# Altium schematic sheet client.SchDoc
size A3
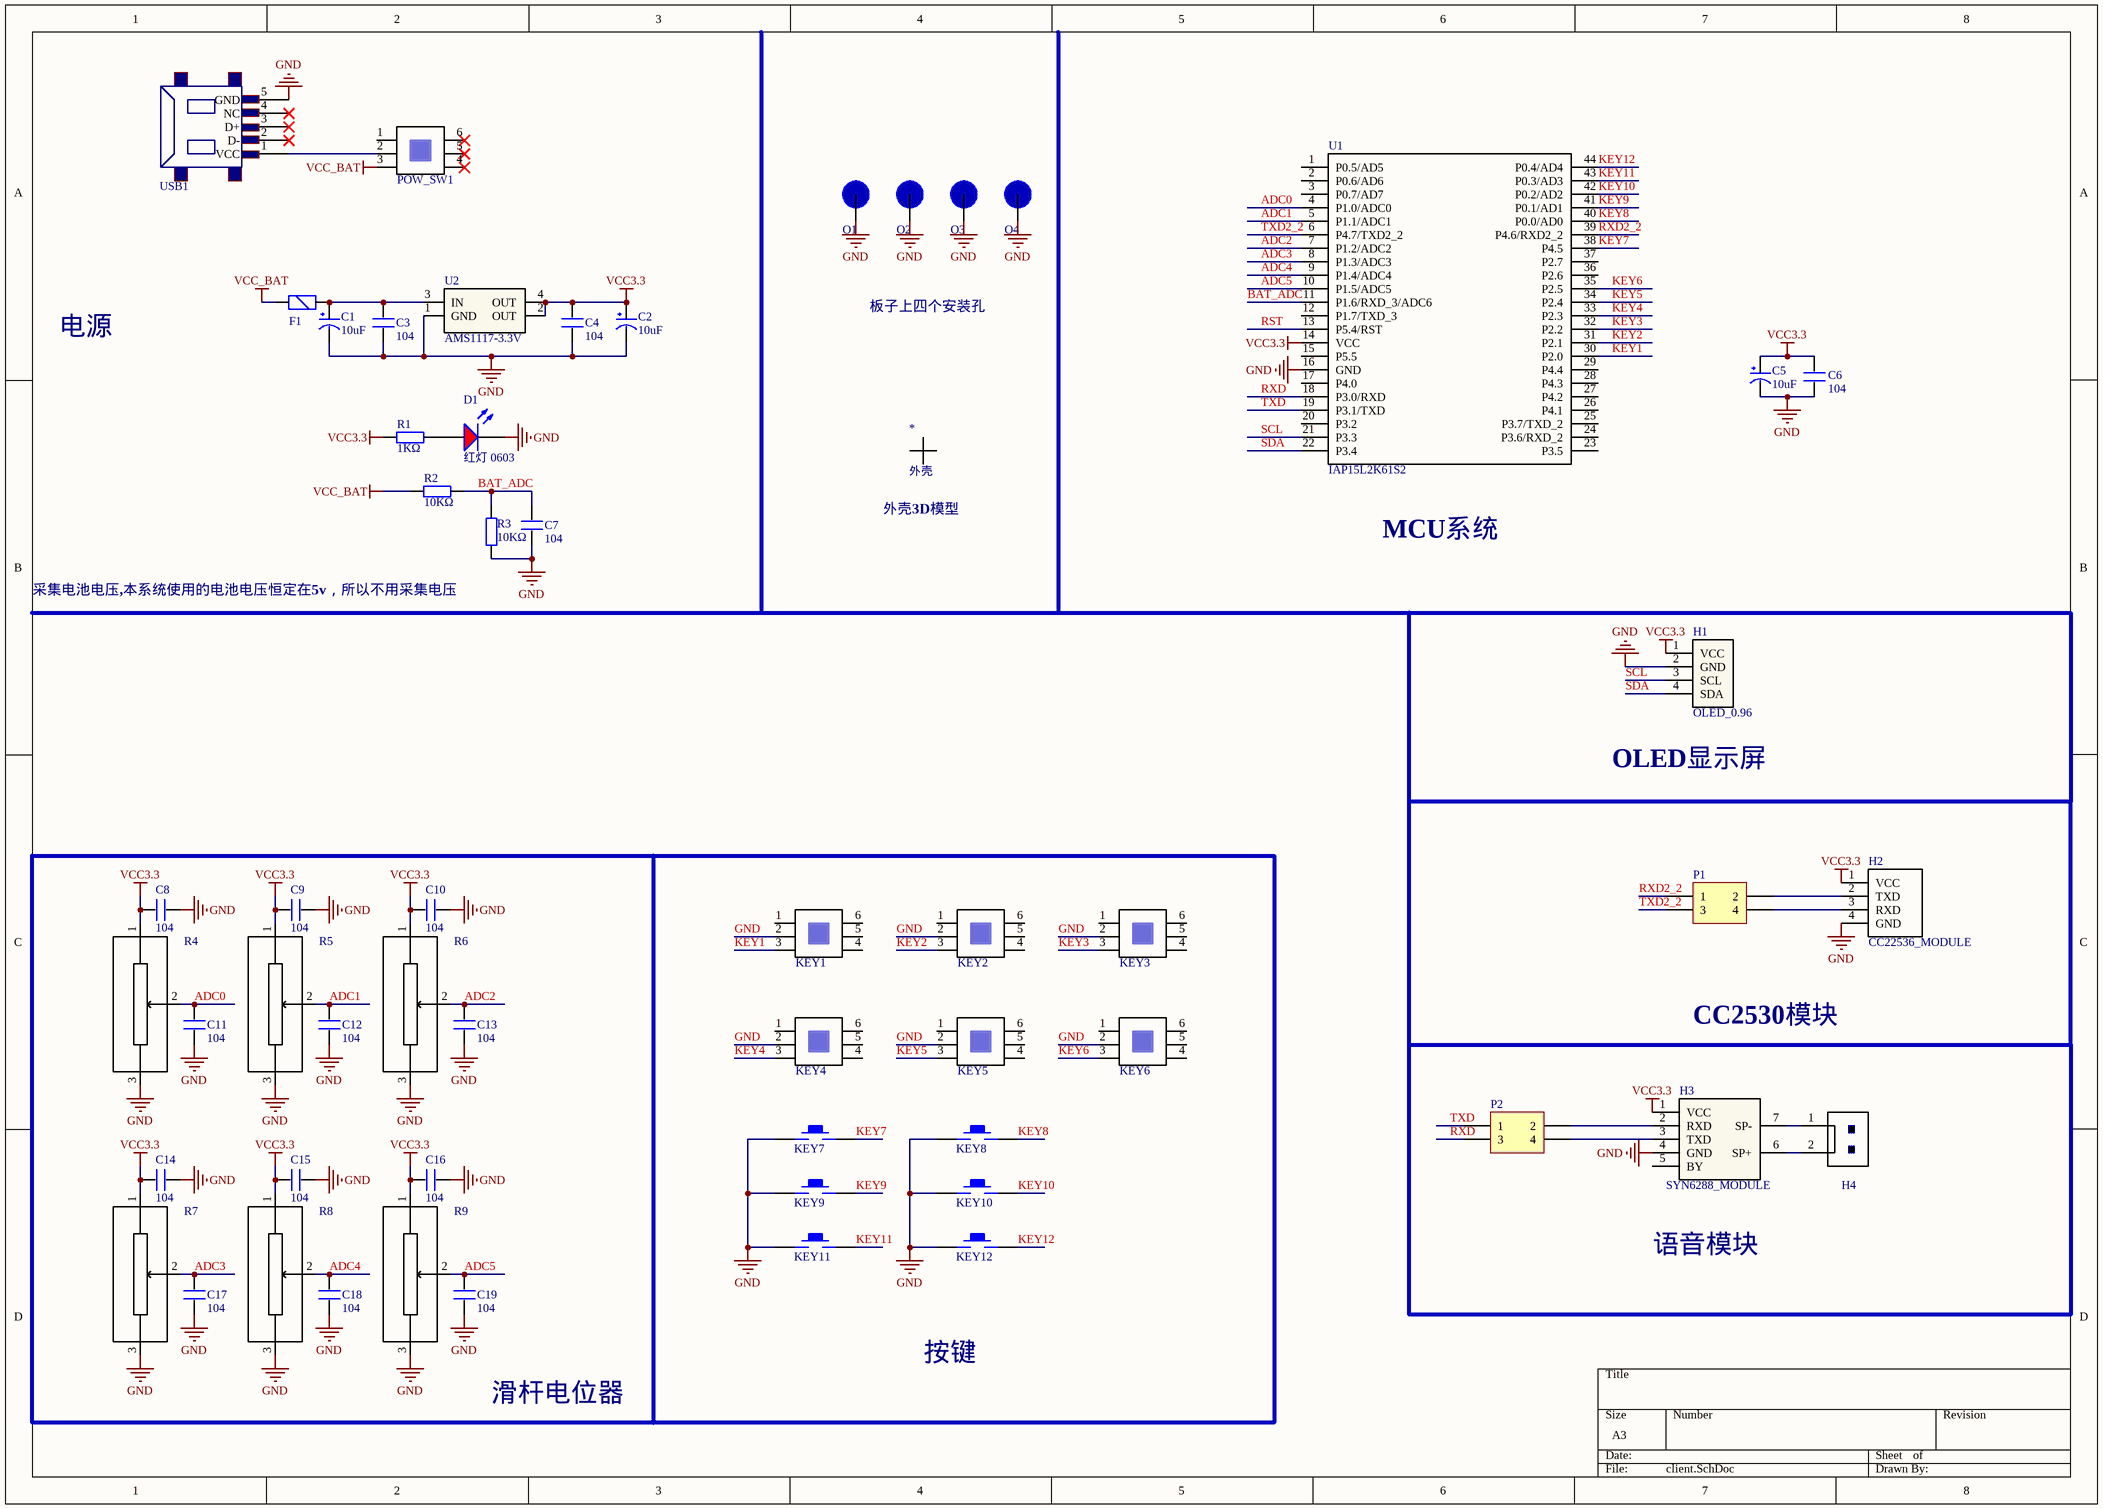
[diagram p0: client.SchDoc]

## Parts
*  外壳  [外壳]
C1  10uF  [C4X4]
C2  10uF  [C4X4]
C3  104  [0603_C]
C4  104  [0603_C]
C5  10uF  [C4X4]
C6  104  [0603_C]
C7  104  [0603_C]
C8  104  [0603_C]
C9  104  [0603_C]
C10  104  [0603_C]
C11  104  [0603_C]
C12  104  [0603_C]
C13  104  [0603_C]
C14  104  [0603_C]
C15  104  [0603_C]
C16  104  [0603_C]
C17  104  [0603_C]
C18  104  [0603_C]
C19  104  [0603_C]
D1  红灯 0603  [0603_LED_S1]
F1  F1  [Fuse1210]  (value not drawn)
H1  OLED_0.96  [HDR1X4]
H2  CC22536_MODULE  [HDR1X4]
H3  SYN6288_MODULE  [SYN6288_MODULE]
H4  排插2*1  [XH2.54mm_2*1]  (value not drawn)
KEY1  switch6pin  [SWITCH_6PIN_8*8mm]  (value not drawn)
KEY2  switch6pin  [SWITCH_6PIN_8*8mm]  (value not drawn)
KEY3  switch6pin  [SWITCH_6PIN_8*8mm]  (value not drawn)
KEY4  switch6pin  [SWITCH_6PIN_8*8mm]  (value not drawn)
KEY5  switch6pin  [SWITCH_6PIN_8*8mm]  (value not drawn)
KEY6  switch6pin  [SWITCH_6PIN_8*8mm]  (value not drawn)
KEY7  KEY_M  [KEY_SMD_6*6*12mm]  (value not drawn)
KEY8  KEY_M  [KEY_SMD_6*6*12mm]  (value not drawn)
KEY9  KEY_M  [KEY_SMD_6*6*12mm]  (value not drawn)
KEY10  KEY_M  [KEY_SMD_6*6*12mm]  (value not drawn)
KEY11  KEY_M  [KEY_SMD_6*6*12mm]  (value not drawn)
KEY12  KEY_M  [KEY_SMD_6*6*12mm]  (value not drawn)
O1  安装孔3mm  (value not drawn)
O2  安装孔3mm  (value not drawn)
O3  安装孔3mm  (value not drawn)
O4  安装孔3mm  (value not drawn)
P1  (no value)  [HDR2X2]
P2  (no value)  [HDR2X2]
POW_SW1  switch6pin  [SWITCH_6PIN_8*8mm]  (value not drawn)
R1  1KΩ  [0603_R]
R2  10KΩ  [0603_R]
R3  10KΩ  [0603_R]
R4  滑杆电位器  [滑杆电位器128mm]  (value not drawn)
R5  滑杆电位器  [滑杆电位器128mm]  (value not drawn)
R6  滑杆电位器  [滑杆电位器128mm]  (value not drawn)
R7  滑杆电位器  [滑杆电位器128mm]  (value not drawn)
R8  滑杆电位器  [滑杆电位器128mm]  (value not drawn)
R9  滑杆电位器  [滑杆电位器128mm]  (value not drawn)
U1  IAP15L2K61S2  [LQFP44]
U2  AMS1117-3.3V  [SOT-223]
USB1  USB1  [USB_MK5P]

## Nets
GND: C1.2(GND) C2.2(GND) C3.2 C4.2 C5.2(GND) C6.2 C7.2 C8.2 C9.2 C10.2 C11.2 C12.2 C13.2 C14.2 C15.2 C16.2 C17.2 C18.2 C19.2 D1.K H1.2(GND) H2.4(GND) H3.4(GND) KEY1.2 KEY2.2 KEY3.2 KEY4.2 KEY5.2 KEY6.2 KEY7.1 KEY8.1 KEY9.1 KEY10.1 KEY11.1 KEY12.1 O1.0(GND) O2.0(GND) O3.0(GND) O4.0(GND) R3.1 R4.3 R5.3 R6.3 R7.3 R8.3 R9.3 U1.16(GND) U2.1(GND) USB1.5(GND)
VCC3.3: C2.1(VCC) C4.1 C5.1(VCC) C6.1 C8.1 C9.1 C10.1 C14.1 C15.1 C16.1 H1.1(VCC) H2.1(VCC) H3.1(VCC) R1.1 R4.1 R5.1 R6.1 R7.1 R8.1 R9.1 U1.14(VCC) U2.2(OUT) U2.4(OUT)
VCC_BAT: F1.2 POW_SW1.3 R2.1
ADC0: C11.1 R4.2 U1.4(P1.0/ADC0)
ADC1: C12.1 R5.2 U1.5(P1.1/ADC1)
ADC2: C13.1 R6.2 U1.7(P1.2/ADC2)
ADC3: C17.1 R7.2 U1.8(P1.3/ADC3)
ADC4: C18.1 R8.2 U1.9(P1.4/ADC4)
ADC5: C19.1 R9.2 U1.10(P1.5/ADC5)
BAT_ADC: C7.1 R2.2 R3.2 U1.11(P1.6/RXD_3/ADC6)
KEY1: KEY1.3 U1.30(P2.0)
KEY2: KEY2.3 U1.31(P2.1)
KEY3: KEY3.3 U1.32(P2.2)
KEY4: KEY4.3 U1.33(P2.3)
KEY5: KEY5.3 U1.34(P2.4)
KEY6: KEY6.3 U1.35(P2.5)
KEY7: KEY7.2 U1.38(P4.5)
KEY8: KEY8.2 U1.40(P0.0/AD0)
KEY9: KEY9.2 U1.41(P0.1/AD1)
KEY10: KEY10.2 U1.42(P0.2/AD2)
KEY11: KEY11.2 U1.43(P0.3/AD3)
KEY12: KEY12.2 U1.44(P0.4/AD4)
RST: U1.13(P5.4/RST)
RXD: P2.3 U1.18(P3.0/RXD)
RXD2_2: P1.1 U1.39(P4.6/RXD2_2)
SCL: H1.3(SCL) U1.21(P3.3)
SDA: H1.4(SDA) U1.22(P3.4)
TXD: P2.1 U1.19(P3.1/TXD)
TXD2_2: P1.3 U1.6(P4.7/TXD2_2)
NetC1_1: C1.1(VCC) C3.1 F1.1 U2.3(IN)
NetD1_A: D1.A R1.2
NetH2_2: H2.2(TXD) P1.2
NetH2_3: H2.3(RXD) P1.4
NetH3_2: H3.2(RXD) P2.2
NetH3_3: H3.3(TXD) P2.4
NetH3_6: H3.6(SP+) H4.2(SP+)
NetH3_7: H3.7(SP-) H4.1(SP-)
NetPOW_SW1_2: POW_SW1.2 USB1.1(VCC)

Not connected (* = marked no-connect by the designer): H3 5(BY); KEY1 1 4 5 6; KEY2 1 4 5 6; KEY3 1 4 5 6; KEY4 1 4 5 6; KEY5 1 4 5 6; KEY6 1 4 5 6; POW_SW1 1 4* 5* 6*; U1 1(P0.5/AD5) 2(P0.6/AD6) 3(P0.7/AD7) 12(P1.7/TXD_3) 15(P5.5) 17(P4.0) 20(P3.2) 23(P3.5) 24(P3.6/RXD_2) 25(P3.7/TXD_2) 26(P4.1) 27(P4.2) 28(P4.3) 29(P4.4) 36(P2.6) 37(P2.7); USB1 2(D-)* 3(D+)* 4(NC)*

## Notes on the sheet
- 板子上四个安装孔
- 电源
- (near *) 外壳3D模型
- MCU系统
- 采集电池电压,本系统使用的电池电压恒定在5v，所以不用采集电压
- (near H1) OLED显示屏
- CC2530模块
- 语音模块
- 按键
- 滑杆电位器

## Library data of the parts
C1 C2 C5 = CAP
C3 C4 C6-C19 = C
D1 = 0603 红灯: 发光二极管; ComponentLink1Description: 供应商链接; ComponentLink1URL: http://www.szlcsc.com/product/details_2659.html; Package: 0603; Supplier: LC; SuppliersPartNumber: C2286
F1 = Fuse
P1 P2 = Header 2X2: Header, 2-Pin, Dual row; LatestRevisionDate: 17-Jul-2002; LatestRevisionNote: Re-released for DXP Platform.; Publisher: Altium Limited
R1-R3 = 0603 1KΩ (1001) 1%: 贴片电阻; ComponentLink1Description: 供应商链接; ComponentLink1URL: http://www.szlcsc.com/product/details_21904.html; Package: 0603; Supplier: LC; SuppliersPartNumber: C21190
U2 = AMS1117
USB1 = USB-5PIN